# EAGLE design power_disc (EAGLE 4.16)
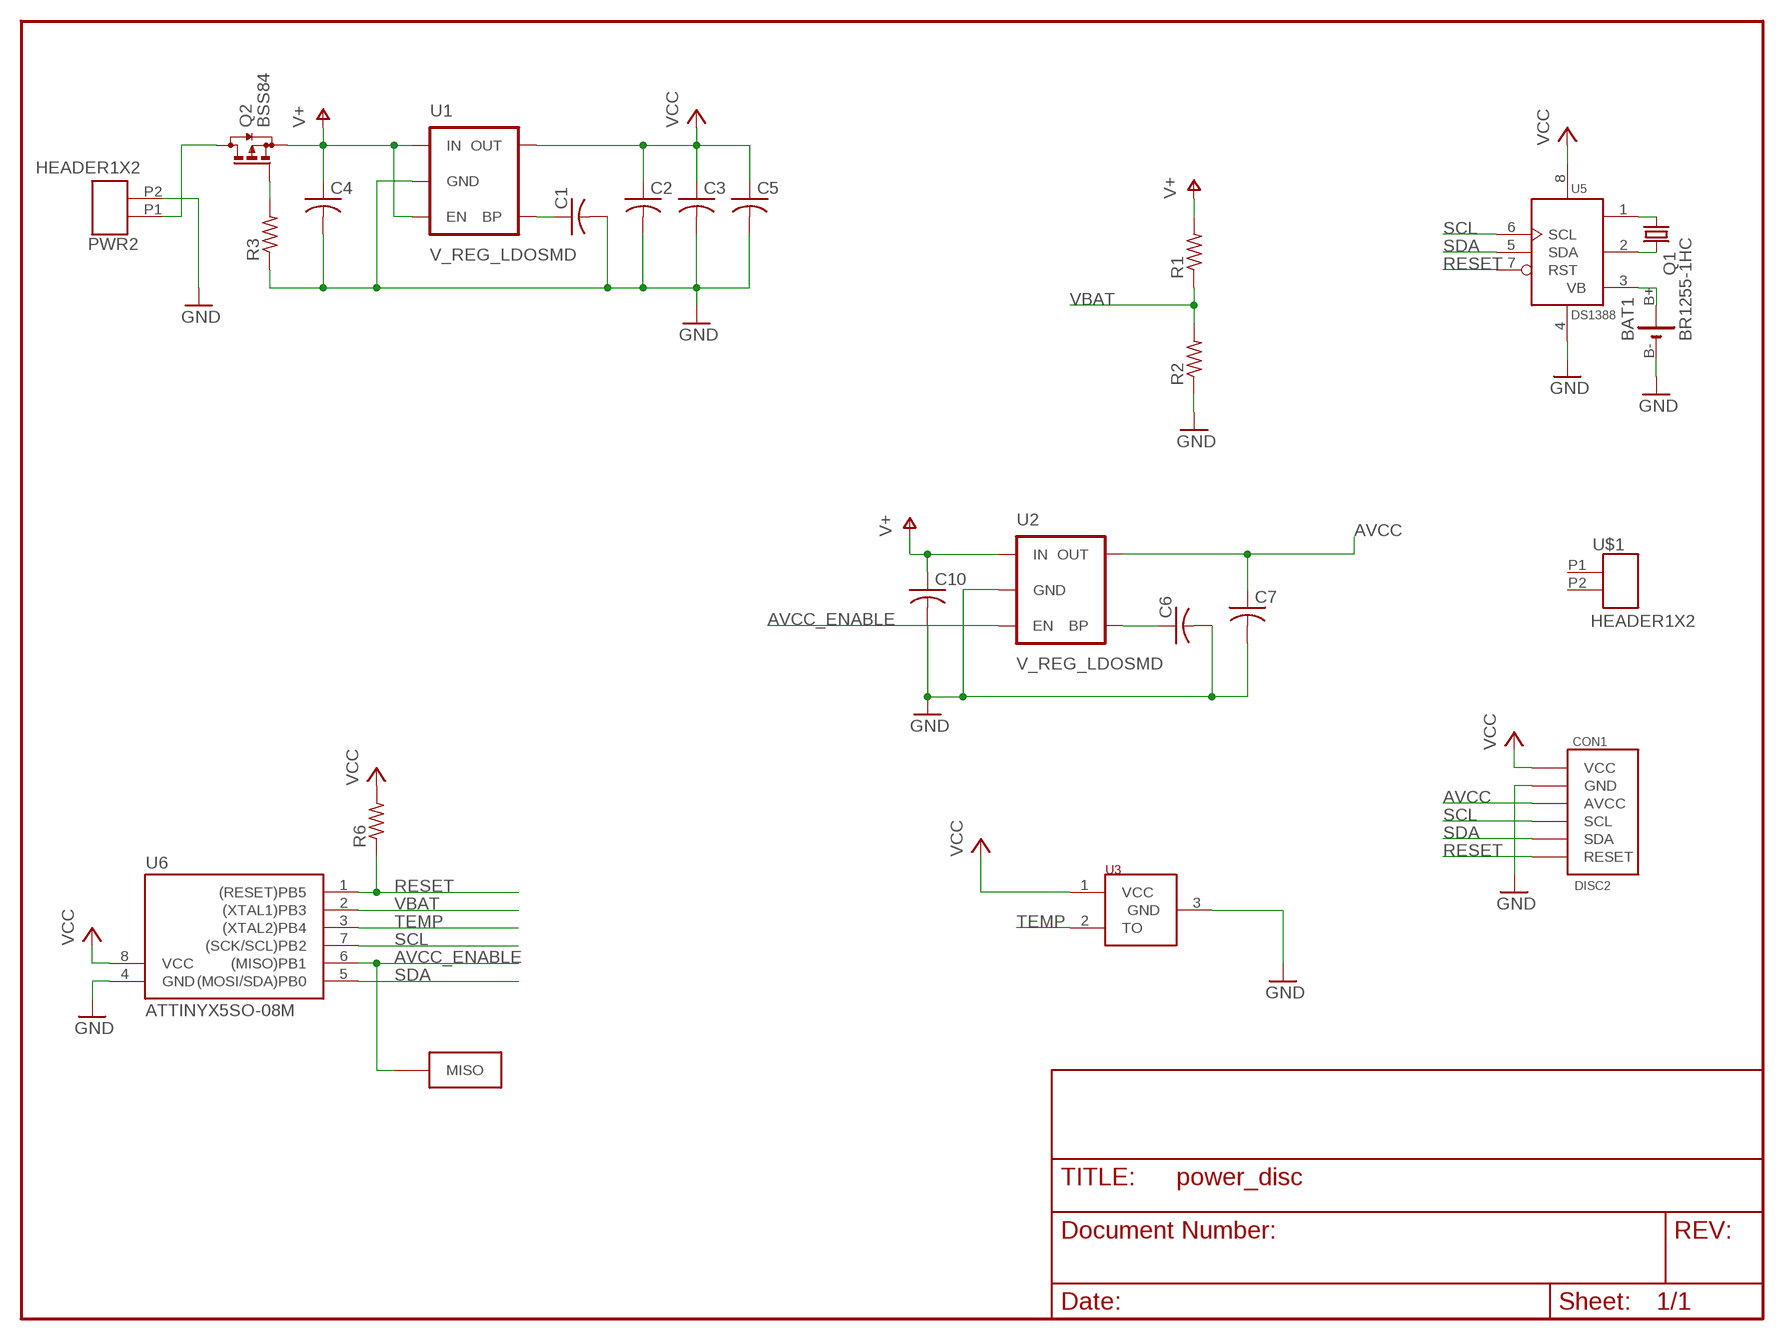
[diagram p0: schematic, sheet 1]

## Parts
BAT1  BR1255-1HC  [BR1225-1HC]
C1  C-USC0805  [C0805]
C2  C-USC0805  [C0805]
C3  C-USC0805  [C0805]
C4  C-USC0805  [C0805]
C5  C-USC0805  [C0805]
C6  C-USC0805  [C0805]
C7  C-USC0805  [C0805]
C10  C-USC0805  [C0805]
CON1  DISC2  [DISC2]
PWR2  HEADER1X2  [HEADER1X2]
Q1  CRYTALTC26H  [TC26H]
Q2  BSS84  [SOT23]
R1  R-US_R0603  [R0603]
R2  R-US_R0603  [R0603]
R3  R-US_R0603  [R0603]
R6  R-US_R0603  [R0603]
U1  V_REG_LDOSMD  [SOT23-5]
U2  V_REG_LDOSMD  [SOT23-5]
U3  LM62  [SOT23]
U5  DS1388  [SOIC8]
U6  ATTINYX5SO-08M  [SO-08M]
U$1  HEADER1X2  [HEADER1X2]
U$2  AVR_ISP_MISO  [AVR_ISP_MISO]

## Nets
AVCC: C7.1 CON1.AVCC U2.5(OUT)
AVCC_ENABLE: U2.3(EN) U6.6((MISO)PB1) U$2.MISO
GND: BAT1.B-(-) C1.2 C2.2 C3.2 C4.2 C5.2 C6.2 C7.2 C10.2 CON1.GND PWR2.P2 R2.1 R3.1 U1.2(GND) U2.2(GND) U3.3(GND) U5.4(GND) U6.4(GND)
N$2: Q1.2 U5.2(X2)
N$3: Q1.1 U5.1(X1)
N$6: Q2.1(G) R3.2
N$7: C1.1 U1.4(BP)
N$8: PWR2.P1 Q2.3(D)
N$17: C6.1 U2.4(BP)
RESET: CON1.RESET R6.1 U5.7(RST) U6.1((RESET)PB5)
SCL: CON1.SCL U5.6(SCL) U6.7((SCK/SCL)PB2)
SDA: CON1.SDA U5.5(SDA) U6.5((MOSI/SDA)PB0)
TEMP: U3.2(TO) U6.3((XTAL2)PB4)
V+: C4.1 C10.1 Q2.2(S) R1.2 U1.1(IN) U1.3(EN) U2.1(IN)
VB: BAT1.B+(+) U5.3(VB)
VBAT: R1.1 R2.2 U6.2((XTAL1)PB3)
VCC: C2.1 C3.1 C5.1 CON1.VCC R6.2 U1.5(OUT) U3.1(VCC) U5.8(VCC) U6.8(VCC)
Unconnected: U$1.P1 U$1.P2

## Library data of the parts
BAT1 = anton:BR1255-1HC
C1-C7 C10 = rcl:C-US: CAPACITOR, American symbol
CON1 = anton:DISC2
PWR2 U$1 = anton:HEADER1X2
Q1 = crystal:CRYTAL: CRYSTAL
Q2 = transistor-small-signal:BSS84: P-CHANNEL MOS FET
R1-R3 R6 = rcl:R-US_: RESISTOR, American symbol
U1 U2 = SparkFunEagle-6-6-07:V_REG_LDO: Voltage Regulator LDO Standard 150mA LDO voltage regulator in SOT-23 layout. Micrel part MIC5205. BP (by-pass) pin is used to lower output noise with 470pF cap.
U3 = mike:LM62
U5 = anton:DS1388
U6 = mike:ATTINYX5
U$2 = anton:AVR_ISP_MISO

## Board
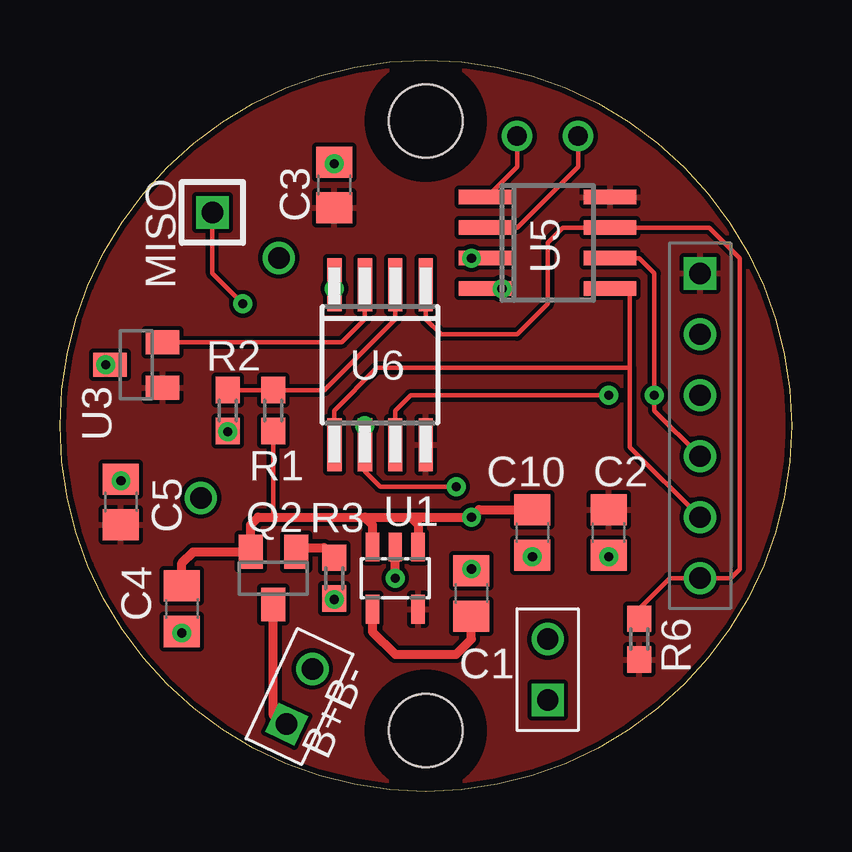
[diagram p1: board, top side]
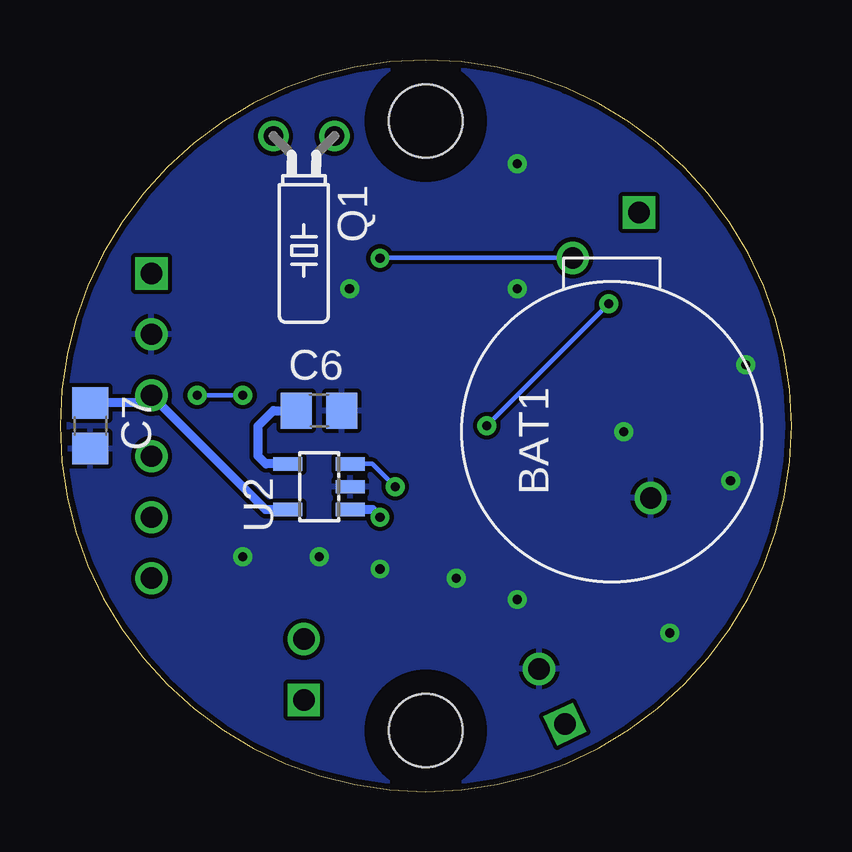
[diagram p2: board, bottom side, seen from below]

Size 30.48 x 30.48 mm. Coordinates in mm from the lower left corner, seen from the top.
Copper layers (1*16): Top 0.035mm / dielectric 1.5mm / Bottom 0.035mm
Design rules "AdvancedCircuts": minimum track width 7mil, minimum drill 15mil, track to track 7mil, track to pad 7mil, pad to pad 7mil, via to via 7mil, smd to smd 0mil, copper to edge 10mil, drill to drill 8mil, minimum pad ring 9mil, minimum via ring 8mil, stop-mask expansion 4mil, vias tented up to drill 0mil, thermal gap 7mil

### Footprints (pad centres in the part's own frame; a part is rotated, then mirrored left to right if it is on the bottom)
BR1225-1HC = drill 0.889 round: B+ 7.25,1.625; B- -2.75,-1.625
C0805 = smd 1.3 x 1.5: 1 -0.95,0; 2 0.95,0
DISC2 = drill 0.889 round: AVCC 11.43,1.27; GND 11.43,3.81; RESET 11.43,-6.35; SCL 11.43,-1.27; SDA 11.43,-3.81 | drill 0.889 square: VCC 11.43,6.35 | hole 3.048: 0,-12.7; 0,12.7
HEADER1X2 = drill 0.889 square: P1 0,1.27 | drill 0.889 round: P2 0,-1.27
TC26H = drill 0.813 round: 1 -1.27,0; 2 1.27,0
SOT23 = smd 1 x 1.4: 1 -0.95,-1.1; 2 0.95,-1.1; 3 0,1.1
R0603 = smd 1.1 x 1: 1 -0.85,0; 2 0.85,0
SOT23-5 = smd 0.55 x 1.2: 1 -0.95,-1.3; 2 0,-1.3; 3 0.95,-1.3; 4 0.95,1.3; 5 -0.95,1.3
SOIC8 = smd 0.6 x 2.2: 1 -1.905,-2.6; 2 -0.635,-2.6; 3 0.635,-2.6; 4 1.905,-2.6; 5 1.905,2.6; 6 0.635,2.6; 7 -0.635,2.6; 8 -1.905,2.6
SO-08M = smd 0.6 x 2.2: 1 -1.905,-3.33; 2 -0.635,-3.33; 3 0.635,-3.33; 4 1.905,-3.33; 5 1.905,3.33; 6 0.635,3.33; 7 -0.635,3.33; 8 -1.905,3.33
AVR_ISP_MISO = drill 0.889 square: MISO 0,0

### Placement (x,y rotation side)
BAT1  7.49,14.99 90 bottom
C1  17.15,8.25 90 top
C2  22.86,10.79 270 top
C3  11.43,25.27 90 top
C4  5.08,7.62 270 top
C5  2.54,12.07 90 top
C6  19.69,15.88 0 bottom
C7  29.21,15.24 270 bottom
C10  19.69,10.79 270 top
CON1  15.24,15.24 0 top
PWR2  9.98,3.96 155 top
Q1  20.32,27.31 180 bottom
Q2  8.89,8.89 180 top
R1  8.89,15.88 270 top
R2  6.99,15.88 90 top
R3  11.43,8.89 90 top
R6  24.13,6.35 270 top
U1  13.97,8.89 180 top
U2  19.69,12.7 90 bottom
U3  3.18,17.78 90 top
U5  20.32,22.86 270 top
U6  13.34,17.78 180 top
U$1  20.32,5.08 180 top
U$2  6.35,24.13 0 top

### Tracks (layer width: path | path; a pad name or v marks a point on that pad's centre or on a via)
AVCC
  Bottom 0.381: C7.1 26.99,16.19 CON1.AVCC 21.91,11.75 U2.5
AVCC_ENABLE  (via drill 0.38)
  Top 0.178: v12.7,15.24 U6.6 12.7,13.34 13.34,12.7 v16.51,12.7 | v7.62,20.32 6.35,21.59 U$2.MISO
  Bottom 0.178: v12.7,15.24 v7.62,20.32 | U2.3 17.46,13.65 v16.51,12.7
GND  (via drill 0.38)
  Top 0.178: C3.2 v11.43,26.16 | C10.2 v19.69,9.78 | C2.2 v22.86,9.78 | U5.4 v18.41,20.95 | C5.2 v2.54,12.95 | U6.4 v11.43,20.95 | R2.1 v6.99,14.99 | U3.3 v1.91,17.78
  Top 0.381: R3.1 v11.43,8 | C1.2 v17.15,9.27 | v13.97,8.89 U1.2 | C4.2 v5.08,6.6
  pour Bottom: 15.24,30.48 arc-90 30.48,15.24 arc-90 15.24,0 arc-90 0,15.24 arc-90
N$2
  Top 0.178: Q1.2 21.59,26.04 19.05,23.5 U5.2
N$3
  Top 0.178: U5.1 17.78,24.76 19.05,26.04 Q1.1
N$6
  Top 0.381: Q2.1 10.01,10.16 11.01,10.16 R3.2
N$7
  Top 0.381: U1.4 13.02,6.66 13.97,5.71 16.51,5.71 17.15,6.35 C1.1
N$8
  Top 0.381: Q2.3 8.89,3.18 9.44,2.62 | 9.44,2.62 9.53,2.54 | PWR2.P1 9.44,2.62
N$17
  Bottom 0.381: U2.4 21.91,13.65 22.23,13.97 22.23,15.24 21.59,15.88 C6.1
RESET
  Top 0.178: U6.1 15.24,19.68 15.88,19.05 19.05,19.05 20.32,20.32 20.32,22.86 20.95,23.5 22.86,23.5 | R6.1 24.13,7.62 25.4,8.89 | 25.4,8.89 CON1.RESET | 25.4,8.89 27.94,8.89 28.32,9.27 28.32,22.22 27.05,23.5 22.86,23.5 | 22.86,23.5 U5.7
SCL  (via drill 0.38)
  Top 0.178: CON1.SCL 24.77,15.88 v24.77,16.51 24.77,21.59 24.13,22.22 U5.6 22.86,22.22 | v22.86,16.51 14.61,16.51 13.97,15.88 U6.7
  Bottom 0.178: v22.86,16.51 v24.77,16.51
SDA
  Top 0.178: CON1.SDA 23.75,14.35 23.75,17.65 | 22.86,20.95 U5.5 23.5,20.95 23.75,20.7 23.75,17.65 | 23.75,17.65 13.21,17.65 11.43,15.88 U6.5
TEMP
  Top 0.178: U6.3 12.7,19.68 11.75,18.73 U3.2
V+  (via drill 0.38)
  Top 0.178: 8.89,11.43 R1.2
  Top 0.381: U1.3 13.02,11.11 12.7,11.43 | 12.7,11.43 8.89,11.43 8.26,11.43 7.94,11.11 Q2.2 5.55,9.99 5.08,9.52 C4.1 | U1.1 14.92,11.11 14.61,11.43 15.24,11.43 | 12.7,11.43 15.24,11.43 | 15.24,11.43 v17.15,11.43 17.46,11.75 C10.1
  Bottom 0.381: U2.1 17.47,11.75 v17.15,11.43
VB  (via drill 0.38)
  Top 0.178: 17.78,22.22 U5.3 v17.15,22.22
  Bottom 0.178: BAT1.B+ 17.13,22.24 v17.15,22.22
VBAT
  Top 0.178: R2.2 R1.1 | R1.1 8.89,16.51 | U6.2 13.97,19.68 11.01,16.73 R1.1
VCC
  pour Top: 15.24,30.48 arc-90 30.48,15.24 arc-90 15.24,0 arc-90 0,15.24 arc-90

### Text on the board
tNames: MISO | B+B-